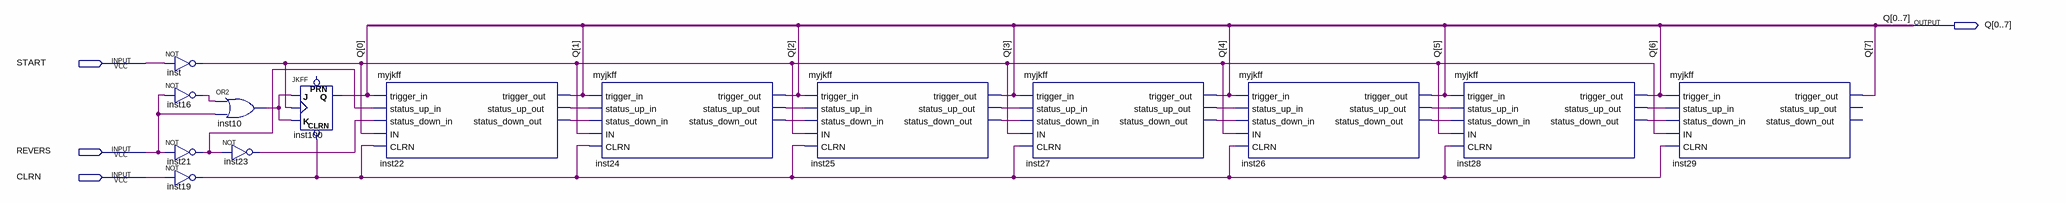
[diagram p0: schematic sheet]
// Quartus schematic reversff_x8_v2.bdf as structural Verilog: 14 symbols, 4 pins
module reversff_x8_v2 (
  input  START,
  input  REVERS,
  input  CLRN,
  output [0:7] Q
);

  wire inst10_out, inst16_out, inst19_out, inst21_out, inst22_status_down_out, inst22_status_up_out,
       inst23_out, inst24_status_down_out, inst24_status_up_out, inst25_status_down_out,
       inst25_status_up_out, inst26_status_down_out, inst26_status_up_out, inst27_status_down_out,
       inst27_status_up_out, inst28_status_down_out, inst28_status_up_out, inst_out;

  not inst (inst_out, START);
  not inst16 (inst16_out, REVERS);
  not inst21 (inst21_out, REVERS);
  not inst19 (inst19_out, CLRN);
  or inst10 (inst10_out, inst16_out, REVERS);
  not inst23 (inst23_out, inst21_out);
  JKFF inst100 (.CLRN(inst19_out), .K(inst10_out), .J(inst10_out), .CLK(inst_out), .Q(Q[0]));  // open: PRN
  myjkff inst22 (
    .trigger_in(Q[0]), .status_up_in(inst21_out), .status_down_in(inst23_out), .IN(inst_out),
    .CLRN(inst19_out), .trigger_out(Q[1]), .status_up_out(inst22_status_up_out),
    .status_down_out(inst22_status_down_out));
  myjkff inst24 (
    .trigger_in(Q[1]), .status_up_in(inst22_status_up_out), .status_down_in(inst22_status_down_out),
    .IN(inst_out), .CLRN(inst19_out), .trigger_out(Q[2]), .status_up_out(inst24_status_up_out),
    .status_down_out(inst24_status_down_out));
  myjkff inst25 (
    .trigger_in(Q[2]), .status_up_in(inst24_status_up_out), .status_down_in(inst24_status_down_out),
    .IN(inst_out), .CLRN(inst19_out), .trigger_out(Q[3]), .status_up_out(inst25_status_up_out),
    .status_down_out(inst25_status_down_out));
  myjkff inst27 (
    .trigger_in(Q[3]), .status_up_in(inst25_status_up_out), .status_down_in(inst25_status_down_out),
    .IN(inst_out), .CLRN(inst19_out), .trigger_out(Q[4]), .status_up_out(inst27_status_up_out),
    .status_down_out(inst27_status_down_out));
  myjkff inst26 (
    .trigger_in(Q[4]), .status_up_in(inst27_status_up_out), .status_down_in(inst27_status_down_out),
    .IN(inst_out), .CLRN(inst19_out), .trigger_out(Q[5]), .status_up_out(inst26_status_up_out),
    .status_down_out(inst26_status_down_out));
  myjkff inst28 (
    .trigger_in(Q[5]), .status_up_in(inst26_status_up_out), .status_down_in(inst26_status_down_out),
    .IN(inst_out), .CLRN(inst19_out), .trigger_out(Q[6]), .status_up_out(inst28_status_up_out),
    .status_down_out(inst28_status_down_out));
  myjkff inst29 (
    .trigger_in(Q[6]), .status_up_in(inst28_status_up_out), .status_down_in(inst28_status_down_out),
    .IN(inst_out), .CLRN(inst19_out), .trigger_out(Q[7]));  // open: status_up_out, status_down_out
endmodule
